# EasyEDA schematic Corona Box Circuit.json
TITLE: Corona Liveticker; REV: 1.0; Date: 2020-04-29; Sheet: 1/1; Company: CSBME
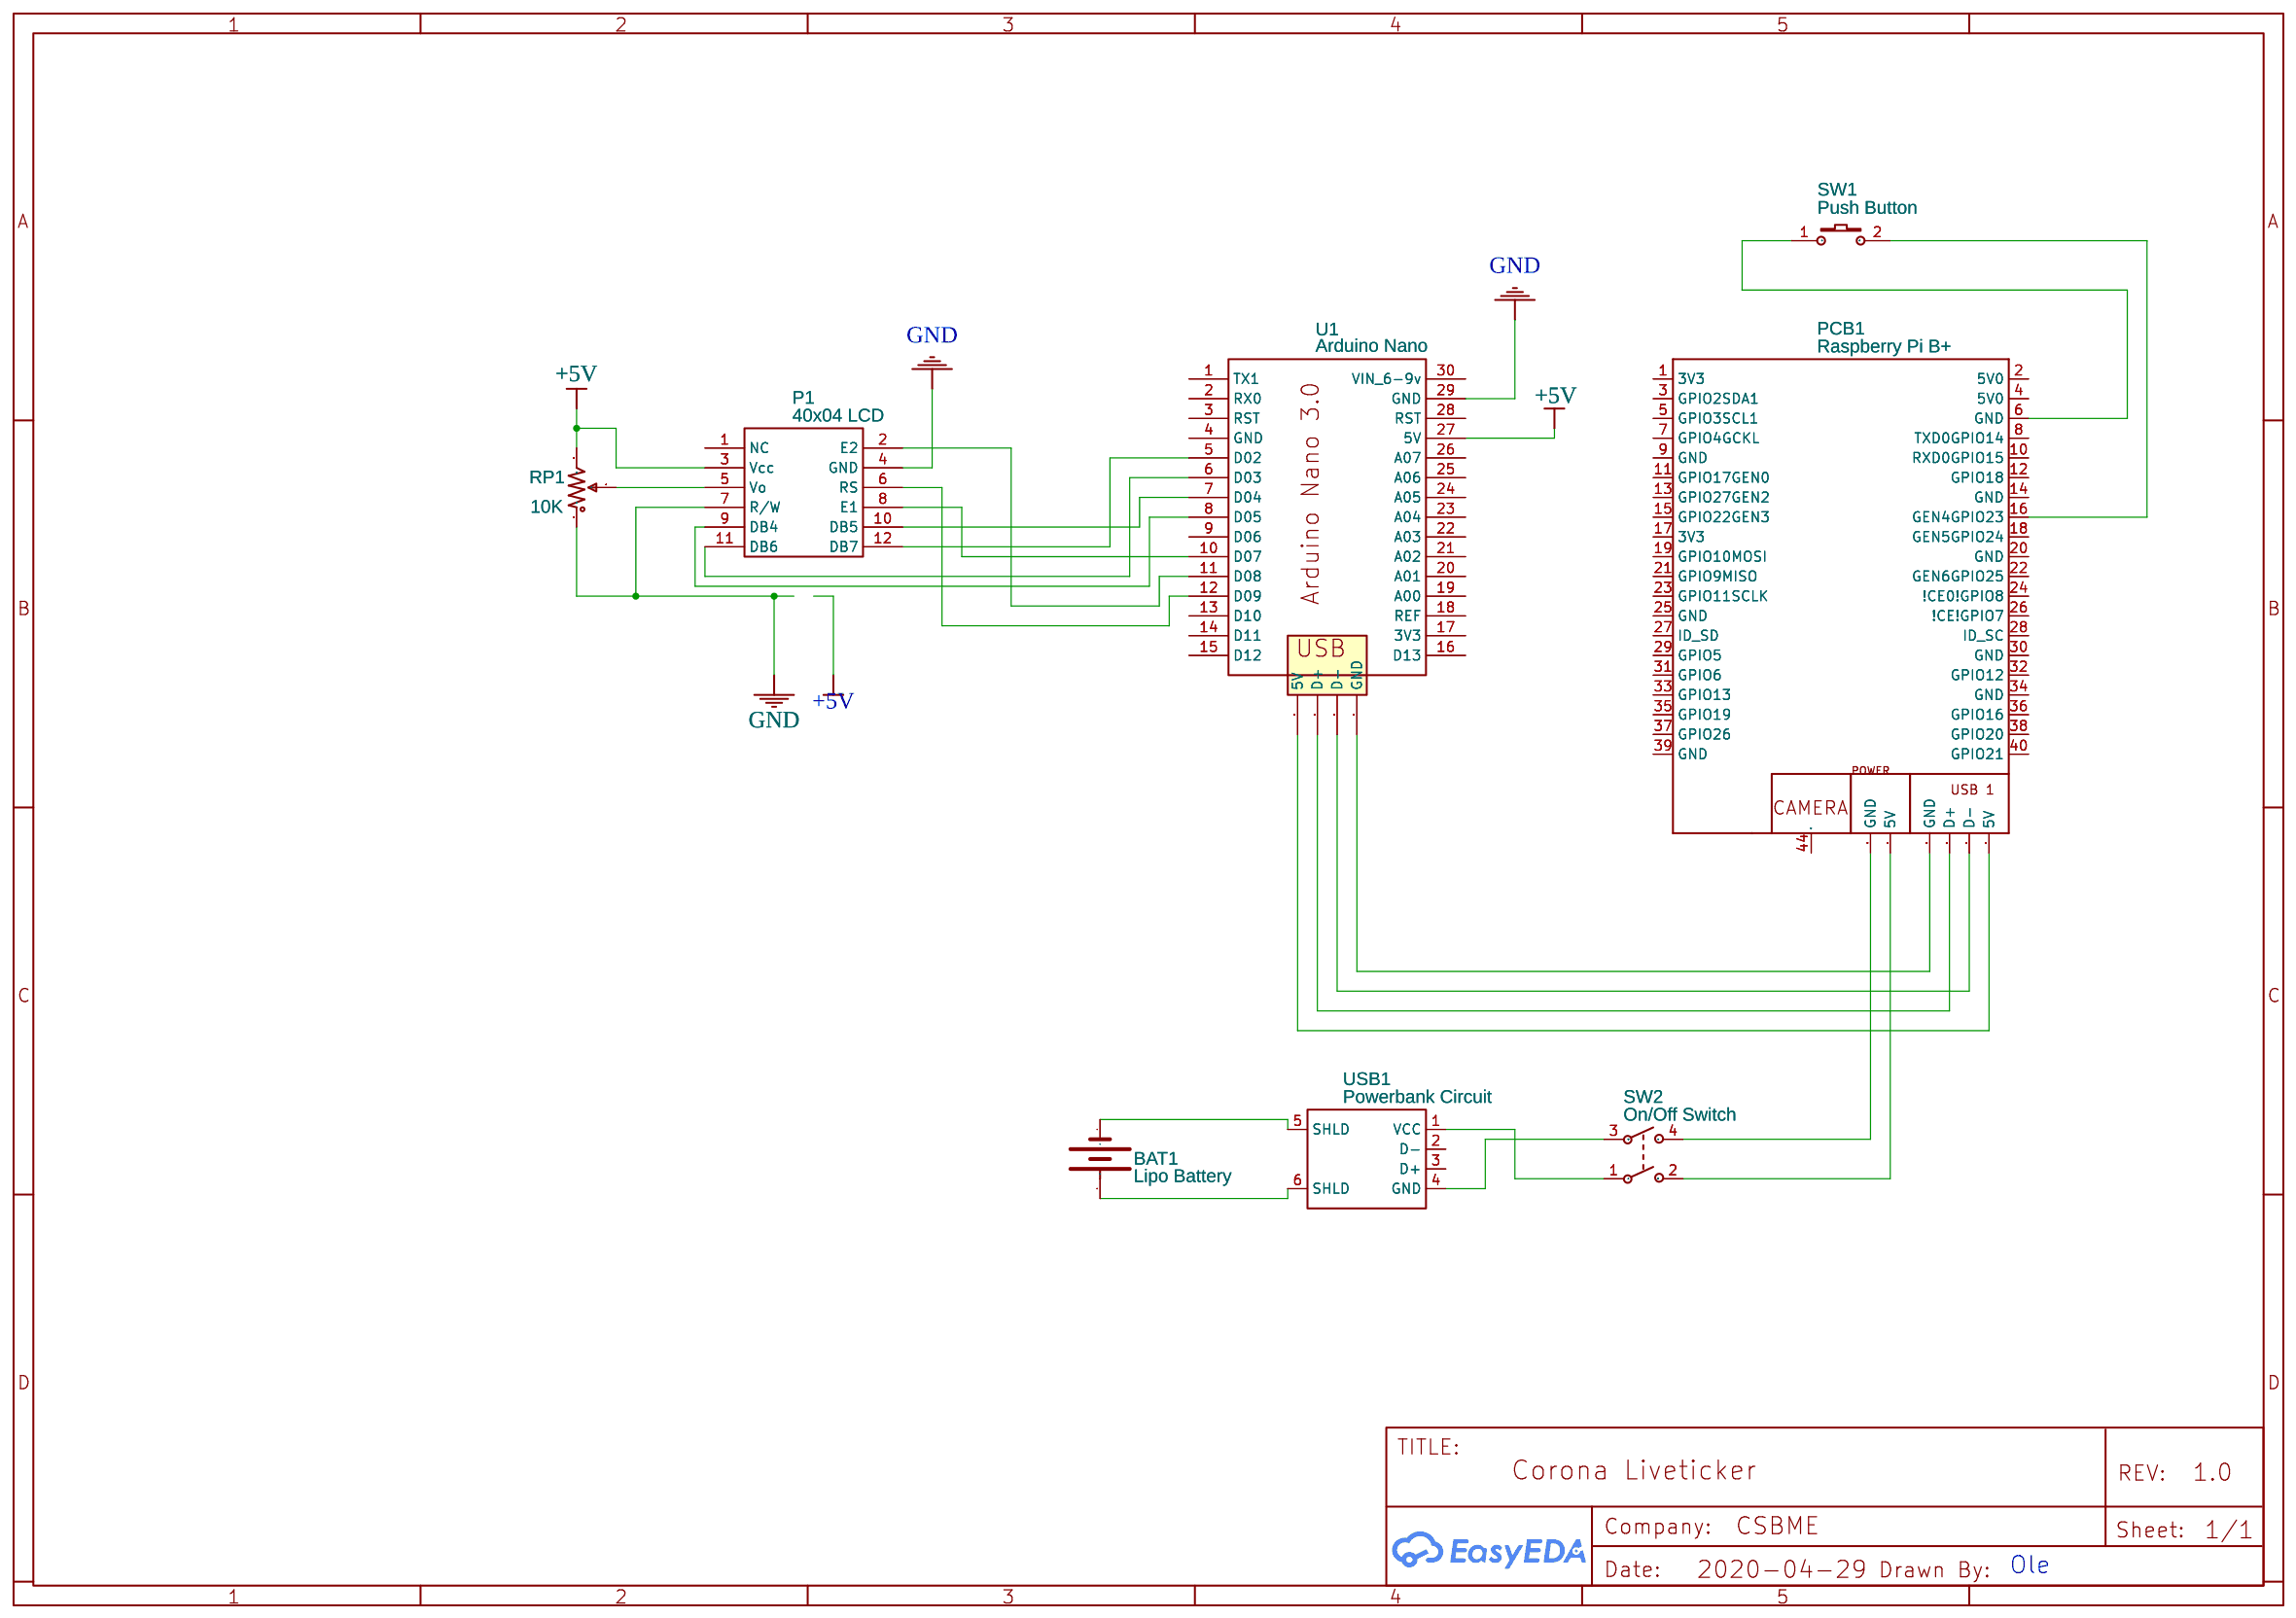
[diagram p0: schematic sheet]

## Parts
BAT1  Lipo Battery  [BATTERY]
DS  none
P1  40x04 LCD  [DS1013-12R IDC-2.54-2X6PW]
PCB1  Raspberry Pi B+  [RASPBERRY_PI_B+]
RP1  10K  [RES-ADJ-TH_3386P]
SW1  Push Button  [KEY-SMD_2P-L6.2-W3.6-LS8.0]
SW2  On/Off Switch
U1  Arduino Nano  [ARDUINO NANO 3.0 NEW]
USB1  Powerbank Circuit  [USB-2.0-A-F-180-JCJ-H17.5-W]

## Library data of the parts
BAT1 = BATTERY: Contributor: SparkFun
P1 = DS1013-12R_LCD40*4: Contributor: gavrila Gavrilov
PCB1 = RASPBERRY-PI-B+_RASPBERRY_PI_3_MINE: sourceId: YysK2k4mE; Contributor: slpollind
RP1 = R_3386P_US: Supplier: LCSC; Contributor: LCEDA_Lib
SW1 = K2-3.6×6.1_SMD: Supplier Part: C118141; Supplier: LCSC; Manufacturer Part: K2-1107ST-A4SW-06; Contributor: LCEDA_Lib; 制造商: 韩国韩荣
SW2 = SW_DPST: Contributor: KiCAD; license: https://www.gnu.org/licenses/lgpl-2.1.html
U1 = ARDUINONANO V3: Manufacturer Part: ArduinoNanov3; link: https://www.arduino.cc/en/uploads/Main/ArduinoNano30Schematic.pdf; Contributor: Lars M
USB1 = Powerbank: Supplier: LCSC; Supplier Part: C168706; Manufacturer: LCSC; Manufacturer Part: USB-A-F-180-W; Contributor: j.malende

## Nets
+5V: P1.3(Vcc) RP1.3 U1.27(5V)
GND: P1.4(GND) P1.7(R/W) RP1.1 U1.29(GND)
Net-(BAT1-+): BAT1.+ USB1.6(SHLD)
Net-(BAT1--): BAT1.- USB1.5(SHLD)
Net-(DS-5V): DS.5V PCB1.PE_BR(D+)
Net-(P1-2): P1.2(E2) U1.11(D08)
Net-(P1-5): P1.5(Vo) RP1.2
Net-(P1-6): P1.6(RS) U1.12(D09)
Net-(P1-8): P1.8(E1) U1.10(D07)
Net-(P1-9): P1.9(DB4) U1.8(D05)
Net-(P1-10): P1.10(DB5) U1.7(D04)
Net-(P1-11): P1.11(DB6) U1.6(D03)
Net-(P1-12): P1.12(DB7) U1.5(D02)
Net-(PCB1-6): PCB1.6(GND) SW1.1
Net-(PCB1-16): PCB1.16(GEN4GPIO23) SW1.2
Net-(PCB1-42): PCB1.42(5V) SW2.2
Net-(PCB1-43): PCB1.43(GND) SW2.4
Net-(SW2-1): SW2.1 USB1.1(VCC)
Net-(SW2-3): SW2.3 USB1.4(GND)

Not connected (* = marked no-connect by the designer): P1 1(NC); PCB1 1(3V3) 2(5V0) 3(GPIO2SDA1) 4(5V0) 5(GPIO3SCL1) 7(GPIO4GCKL) 8(TXD0GPIO14) 9(GND) 10(RXD0GPIO15) 11(GPIO17GEN0) 12(GPIO18) 13(GPIO27GEN2) 14(GND) 15(GPIO22GEN3) 17(3V3) 18(GEN5GPIO24) 19(GPIO10MOSI) 20(GND) 21(GPIO9MISO) 22(GEN6GPIO25) 23(GPIO11SCLK) 24(!CE0!GPIO8) 25(GND) 26(!CE!GPIO7) 27(ID_SD) 28(ID_SC) 29(GPIO5) 30(GND) 31(GPIO6) 32(GPIO12) 33(GPIO13) 34(GND) 35(GPIO19) 36(GPIO16) 37(GPIO26) 38(GPIO20) 39(GND) 40(GPIO21) 44(27); U1 1(TX1) 2(RX0) 3(RST) 4(GND) 9(D06) 13(D10) 14(D11) 15(D12) 16(D13) 17(3V3) 18(REF) 19(A00) 20(A01) 21(A02) 22(A03) 23(A04) 24(A05) 25(A06) 26(A07) 28(RST) 30(VIN 6-9v); USB1 2(D-) 3(D+)

## Notes on the sheet
- Ole
